# EAGLE design mini-bridge (EAGLE 5.07)
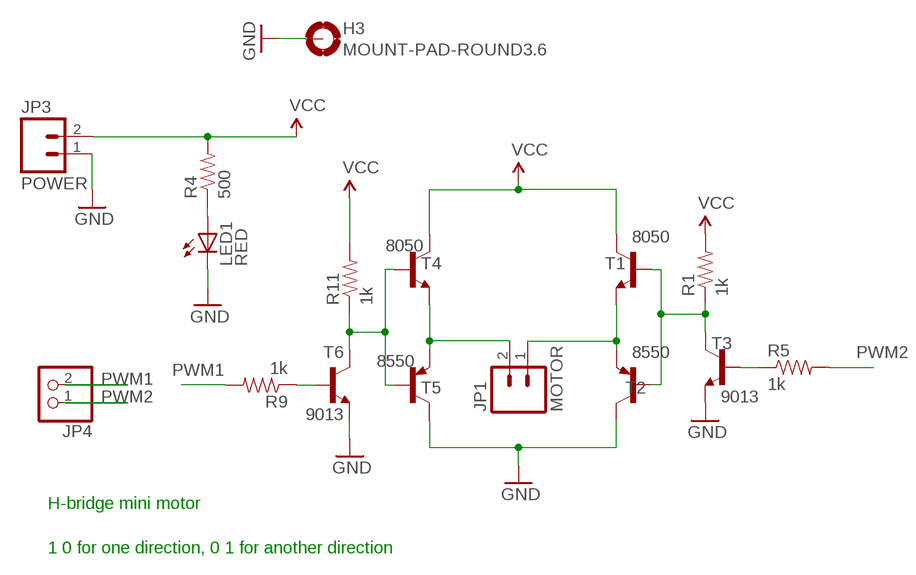
[diagram p0: schematic, sheet 1]

## Parts
H3  MOUNT-PAD-ROUND3.6  [3,6-PAD]
JP1  MOTOR  CON-02-XH  [XH-1X2-LONG-LOCK]
JP3  POWER  CON-02-XH  [XH-1X2-LONG-LOCK]
JP4  PINHD-1X2/90  [1X02/90]
LED1  RED  LED0805  [CHIPLED_0805]
R1  1k  RESISTOR  [0805]
R4  500  RESISTOR0805  [0805]
R5  1k  RESISTOR0805  [0805]
R9  1k  RESISTOR0805  [0805]
R11  1k  RESISTOR0805  [0805]
T1  8050  BC808-NPN-SOT23-BEC  [SOT23-BEC]
T2  8550  BC857C-PNP-SOT23-BEC  [SOT23-BEC]
T3  9013  TRANSISTOR_NPNSOT23  [SOT23]
T4  8050  BC808-NPN-SOT23-BEC  [SOT23-BEC]
T5  8550  BC807-16-PNP-SOT23-BEC  [SOT23-BEC]
T6  9013  TRANSISTOR_NPNSOT23  [SOT23]

## Nets
GND: H3.B3,6(MOUNT) JP3.1 LED1.C T2.C T3.2(E) T5.C T6.2(E)
N$1: LED1.A R4.1
N$2: JP1.1 T1.E T2.E
N$3: R9.1 T6.1(B)
N$6: R11.1 T4.B T5.B T6.3(C)
N$7: R1.1 T1.B T2.B T3.3(C)
N$10: R5.1 T3.1(B)
N$17: JP1.2 T4.E T5.E
PWM1: JP4.2 R9.2
PWM2: JP4.1 R5.2
VCC: JP3.2 R1.2 R4.2 R11.2 T1.C T4.C

## Notes on the sheet
- H-bridge mini motor
- 1 0 for one direction, 0 1 for another direction

## Library data of the parts
H3 = holes:MOUNT-PAD-ROUND: MOUNTING PAD, round
JP1 JP3 = digital-toy:CON-02: Header 2 Standard 2-pin 0.1" header. Use with straight break away headers (SKU : PRT-00116), right angle break away headers (PRT-00553), swiss pins (PRT-00743), machine pins (PRT-00117), and female headers (PRT-00115). Molex polarized connector foot print use with SKU : PRT-08233 with associated crimp pins and housings.
JP4 = pinhead:PINHD-1X2: PIN HEADER
LED1 = digital-toy:LED: LEDs Standard schematic elements and footprints for 5mm, 3mm, 1206, and 0603 sized LEDs. 5mm - Spark Fun Electronics SKU : COM-00529 (and others) copy led.lbr 0805 led here, by hyl digital-toy. 2010.6.29
R1 = SparkFun:RESISTOR: Resistor
R4 R5 R9 R11 = digital-toy:RESISTOR: Resistor
T1 T4 = digital-toy:*-NPN-: NPN Transistror most of sot-23 use the pacages sot23-BEC, top C, left B, right E. by hyl, digital-toy. and to-92 use ebc(from-top) by hyl, digital-toy.
T2 T5 = digital-toy:*-PNP-: PNP Transistror
T3 T6 = digital-toy:TRANSISTOR_NPN: Transistor NPN BJT configuration in SOT23 package. MMBT2222 is the common NPN we use. Double check BCE configuration again layout. copy from spark-fun, here is the typical sot-23,to-92 tansistor, sot23-BEC, to92-EBC,compare to *NPN* device, by hyl

## Board
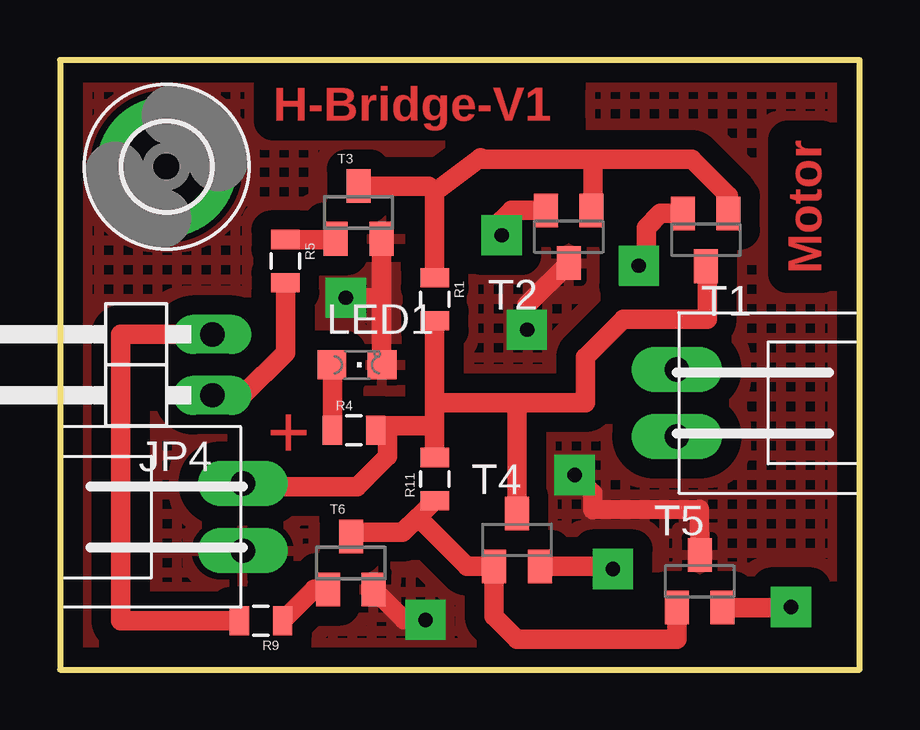
[diagram p1: board, top side]
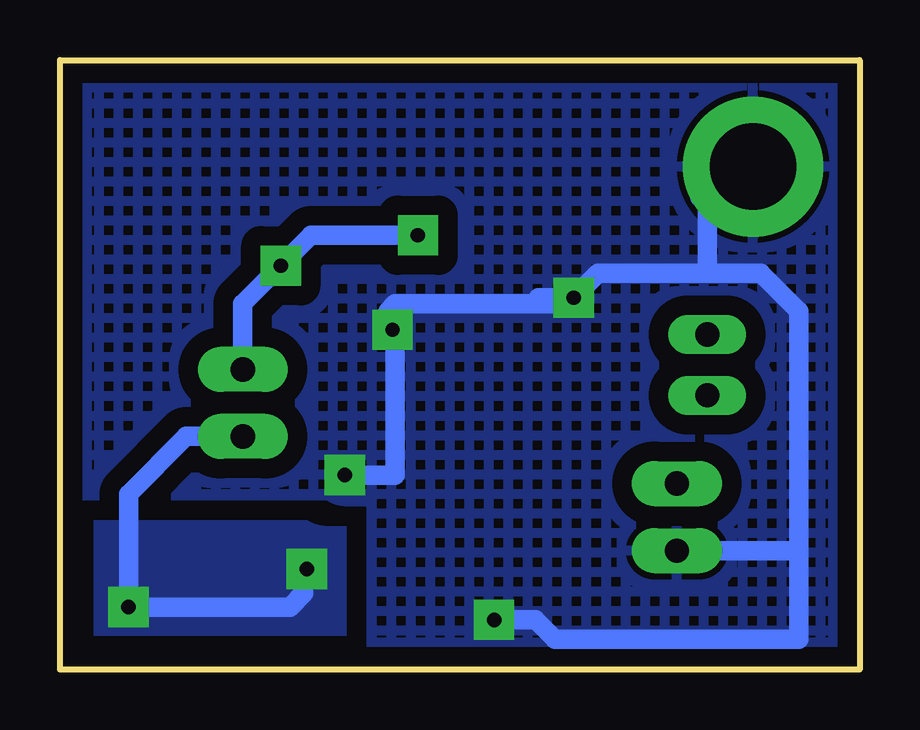
[diagram p2: board, bottom side, seen from below]

Size 33.34 x 25.4 mm. Coordinates in mm from the lower left corner, seen from the top.
Outline: 0,0 33.34,0 33.34,25.4 0,25.4 0,0
Copper layers (1*16): Top 0.035mm / dielectric 1.5mm / Bottom 0.035mm
Design rules "SparkFun-HP1007-600x600dpi": minimum track width 10mil, minimum drill 20mil, track to track 12mil, track to pad 12mil, pad to pad 12mil, via to via 12mil, smd to smd 12mil, copper to edge 12mil, drill to drill 12mil, minimum pad ring 12mil, minimum via ring 10mil, stop-mask expansion 4mil, vias tented up to drill 25mil, thermal gap 10mil

### Footprints (pad centres in the part's own frame; a part is rotated, then mirrored left to right if it is on the bottom)
3,6-PAD = drill 3.6 pad 5.842 round: B3,6 0,0
XH-1X2-LONG-LOCK = drill 1.016 pad 1.88 long: 1 -1.397,0; 2 1.397,0
1X02/90 = drill 1.016 long: 1 -1.27,-3.81; 2 1.27,-3.81
CHIPLED_0805 = smd 1.2 x 1.2: A 0,-1.05; C 0,1.05
0805 = smd 0.8 x 1.2: 1 -0.9,0; 2 0.9,0
SOT23-BEC = smd 1 x 1.4: B -0.95,-1.1; C 0,1.1; E 0.95,-1.1
SOT23 = smd 1 x 1.4: 1 -0.95,-1.1; 2 0.95,-1.1; 3 0,1.1

### Placement (x,y rotation side)
H3  4.45,20.95 0 top
JP1  25.72,11.11 270 top
JP3  7.62,6.35 90 top
JP4  2.54,12.7 90 top
LED1  12.38,12.7 270 top
R1  15.62,15.43 270 top
R4  12.26,9.97 0 top
R5  9.4,17.02 270 top
R9  8.38,2.03 180 top
R11  15.62,7.94 90 top
T1  26.92,17.91 180 top
T2  21.21,18.03 180 top
T3  12.45,19.05 0 top
T4  19.05,5.4 0 top
T5  26.67,3.68 0 top
T6  12.13,4.45 0 top

### Tracks (layer width: path | path; a pad name or v marks a point on that pad's centre or on a via)
GND  (via drill 0.6 pad 1.68)
  Top 0.813: 13.4,15.49 v11.92,15.49 11.75,15.32 | 13.4,15.49 T3.2 | T5.C 26.65,6.69 22.23,6.67 22.23,7.34 v21.46,8.11 | T6.2 14.35,2.08 v15.24,2.08 | v19.47,14.16 19.47,15.2 T2.C | LED1.C 13.4,12.74 13.4,15.49
  Bottom 0.813: 19.37,15.24 12.87,15.24 v11.92,15.49 | v21.46,8.11 19.37,8.11 19.37,15.24 | 2.54,4.95 2.54,1.27 12.7,1.27 13.51,2.08 v15.24,2.08 | H3.B3,6 5.08,20.95 6.67,19.68 6.35,19.68 6.35,16.51 | 13.14,15.24 13.4,15.49 v11.92,15.49 | v11.92,15.49 10.9,16.51 6.35,16.51 | 19.37,15.24 19.66,14.92 v19.47,14.16 | 2.54,4.95 JP3.1 | 2.54,4.95 2.54,14.92 4.13,16.51 6.35,16.51
  pour Bottom (isolate 0.813, rank 6, hatched): -5.4,29.53 37.15,29.84 36.2,-2.22 -2.22,-2.54
  pour Top (isolate 0.813, hatched): -1.91,26.99 34.92,26.99 38.1,22.54 38.1,1.59 33.66,-2.86 0,-2.86 -3.49,0.64 -3.49,25.4
N$1
  Top 0.813: LED1.A 11.36,12.68 R4.1
N$2  (via drill 0.6 pad 1.68)
  Top 0.813: T2.E 18.82,19.13 18.41,18.73 v18.41,18.1 | T1.E 25.04,19.01 24.45,18.41 24.45,17.14 v24.13,16.83
  Bottom 0.813: v18.41,18.1 22.86,18.1 v24.13,16.83 25.72,15.24 JP1.1
N$3
  Top 0.813: R9.1 10.6,3.35 T6.1
N$6
  Top 0.813: T5.B 25.72,1.27 19.05,1.27 18.1,2.22 T4.B 16.98,4.3 14.92,6.35 | T6.3 12.3,5.71 14.29,5.71 14.92,6.35 | 14.92,6.35 R11.1
N$7
  Top 0.813: 15.62,19.9 R1.1 | T3.3 15.37,20.15 15.62,19.9 | 15.62,19.9 17.53,21.34 17.46,21.27 22.23,21.27 | 22.23,21.27 22.23,19.2 T2.B | T1.B 27.87,19.75 26.35,21.27 22.23,21.27
N$10
  Top 0.813: R5.1 11.46,17.92 T3.1
N$17  (via drill 0.6 pad 1.68)
  Top 0.813: T5.E 30.18,2.58 v30.48,2.6 | T4.E 23.05,4.3 v23.05,4.19
  Bottom 0.813: JP1.2 28.07,9.72 30.48,7.3 v30.48,2.6 23.75,2.6 23.18,3.17 23.18,4.06 v23.05,4.19
  pour Bottom (isolate 1.27, rank 2): 35.24,6.03 21.59,6.03 21.59,1.27 35.24,0.95
PWM1
  Top 0.813: R9.2 2.54,2.03 2.54,13.97 JP4.2
PWM2
  Top 0.813: 9.4,13.97 R5.2 9.4,13.21 7.62,11.43 JP4.1
VCC
  Top 0.813: 19.05,11.11 T4.C | 19.05,11.11 21.91,11.11 21.91,13.02 23.5,14.61 26.99,14.61 26.99,16.74 T1.C | 15.57,8.89 R11.2 15.62,10.16 | 15.62,10.16 15.62,11.11 | 15.62,11.11 R1.2 | 15.62,11.11 19.05,11.11 | R4.2 13.35,10.16 13.65,10.16 | 13.65,10.16 15.62,10.16 | JP3.2 7.75,7.62 12.38,7.62 13.65,8.89 13.65,10.16

### Text on the board
Top: H-Bridge-V1 | Motor | +